# EAGLE design mattduino_mega_nano (EAGLE 9.1.0)

## Sheet 1 of 3: CPU
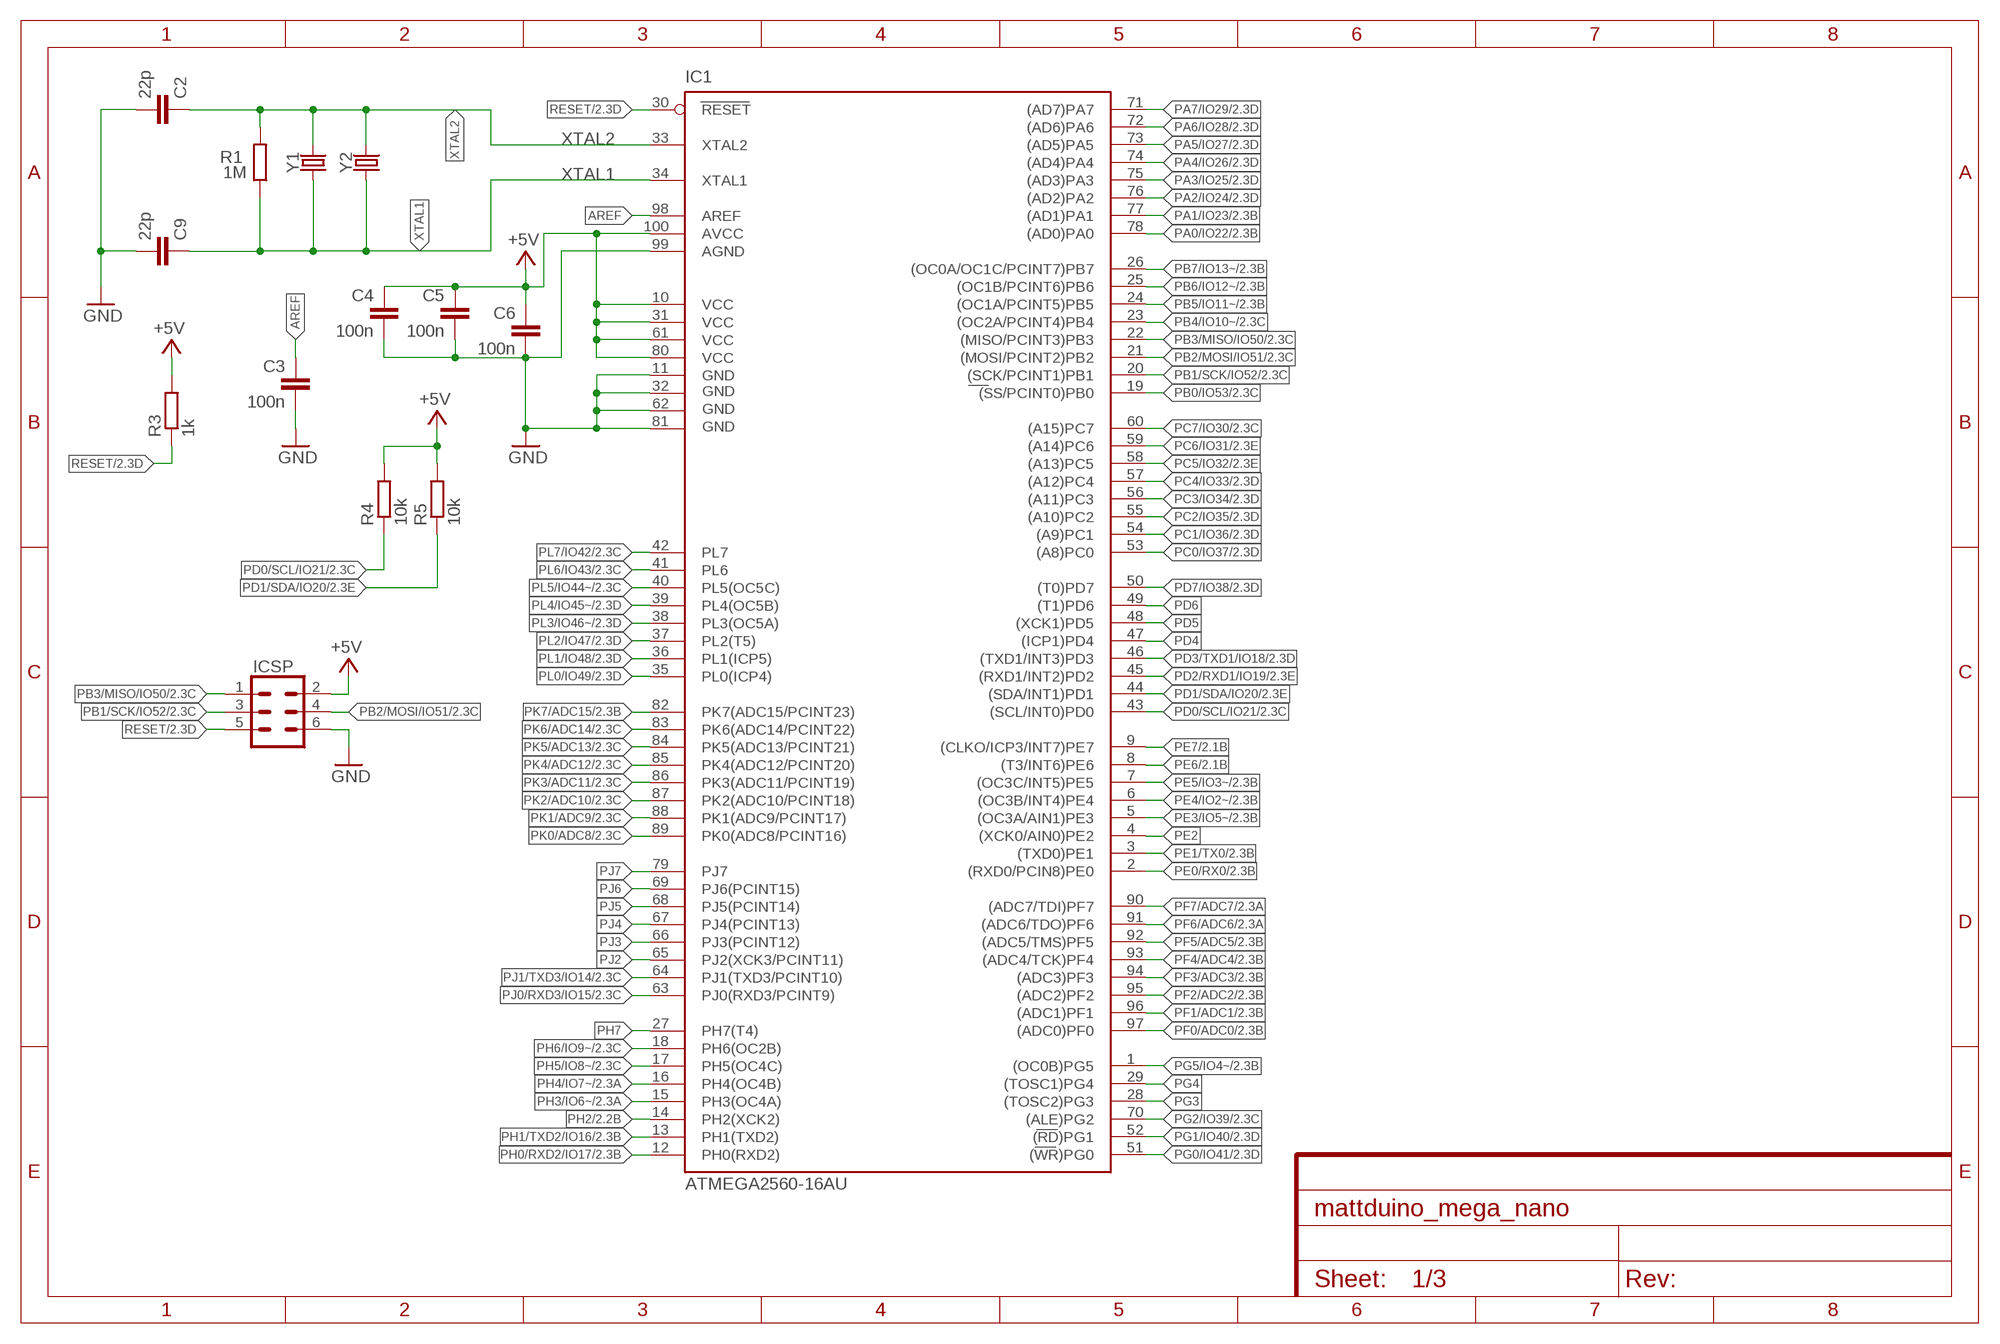
[diagram p0: schematic, sheet 1]

### Parts
C2  22p  C-EUC0603  [C0603]
C3  100n  C-EUC0603  [C0603]
C4  100n  C-EUC0603  [C0603]
C5  100n  C-EUC0603  [C0603]
C6  100n  C-EUC0603  [C0603]
C9  22p  C-EUC0603  [C0603]
IC1  ATMEGA2560-16AU  ATMEGA25602560-16AU  [TQFP100]
ICSP  CONN_03X2SHROUD  [2X3-SHROUDED]
R1  1M  R-EU_R0603  [R0603]
R3  1k  R-EU_R0603  [R0603]
R4  10k  R-EU_R0603  [R0603]
R5  10k  R-EU_R0603  [R0603]
Y1  CRYSTALPTH-HC49UV  [HC49U]
Y2  CRYSTALSMD-HC49UP  [HC49UP]

### Nets
+5V [power usb]: C4.1 C5.1 C6.1 IC1.10(VCC) IC1.31(VCC1) IC1.61(VCC2) IC1.80(VCC3) IC1.100(AVCC) ICSP.2 R3.2 R4.2 R5.2 ; also sheet 2,3
AREF: C3.1 IC1.98(AREF)
GND [gnd]: C2.2 C3.2 C4.2 C5.2 C6.2 C9.2 IC1.11(GND) IC1.32(GND1) IC1.62(GND2) IC1.81(GND3) IC1.99(AGND) ICSP.6 ; also sheet 2,3
PA0/IO22: IC1.78((AD0)PA0) ; also sheet 2
PA1/IO23: IC1.77((AD1)PA1) ; also sheet 2
PA2/IO24: IC1.76((AD2)PA2) ; also sheet 2
PA3/IO25: IC1.75((AD3)PA3) ; also sheet 2
PA4/IO26: IC1.74((AD4)PA4) ; also sheet 2
PA5/IO27: IC1.73((AD5)PA5) ; also sheet 2
PA6/IO28: IC1.72((AD6)PA6) ; also sheet 2
PA7/IO29: IC1.71((AD7)PA7) ; also sheet 2
PB0/IO53: IC1.19((SS/PCINT0)PB0) ; also sheet 2
PB1/SCK/IO52: IC1.20((SCK/PCINT1)PB1) ICSP.3 ; also sheet 2
PB2/MOSI/IO51: IC1.21((MOSI/PCINT2)PB2) ICSP.4 ; also sheet 2
PB3/MISO/IO50: IC1.22((MISO/PCINT3)PB3) ICSP.1 ; also sheet 2
PB4/IO10~: IC1.23((OC2A/PCINT4)PB4) ; also sheet 2
PB5/IO11~: IC1.24((OC1A/PCINT5)PB5) ; also sheet 2
PB6/IO12~: IC1.25((OC1B/PCINT6)PB6) ; also sheet 2
PB7/IO13~: IC1.26((OC0A/OC1C/PCINT7)PB7) ; also sheet 2
PC0/IO37: IC1.53((A8)PC0) ; also sheet 2
PC1/IO36: IC1.54((A9)PC1) ; also sheet 2
PC2/IO35: IC1.55((A10)PC2) ; also sheet 2
PC3/IO34: IC1.56((A11)PC3) ; also sheet 2
PC4/IO33: IC1.57((A12)PC4) ; also sheet 2
PC5/IO32: IC1.58((A13)PC5) ; also sheet 2
PC6/IO31: IC1.59((A14)PC6) ; also sheet 2
PC7/IO30: IC1.60((A15)PC7) ; also sheet 2
PD0/SCL/IO21: IC1.43((SCL/INT0)PD0) R4.1 ; also sheet 2
PD1/SDA/IO20: IC1.44((SDA/INT1)PD1) R5.1 ; also sheet 2
PD2/RXD1/IO19: IC1.45((RXD1/INT2)PD2) ; also sheet 2
PD3/TXD1/IO18: IC1.46((TXD1/INT3)PD3) ; also sheet 2
PD4: IC1.47((ICP1)PD4)
PD5: IC1.48((XCK1)PD5)
PD6: IC1.49((T1)PD6)
PD7/IO38: IC1.50((T0)PD7) ; also sheet 2
PE0/RX0: IC1.2((RXD0/PCIN8)PE0) ; also sheet 2
PE1/TX0: IC1.3((TXD0)PE1) ; also sheet 2
PE2: IC1.4((XCK0/AIN0)PE2)
PE3/IO5~: IC1.5((OC3A/AIN1)PE3) ; also sheet 2
PE4/IO2~: IC1.6((OC3B/INT4)PE4) ; also sheet 2
PE5/IO3~: IC1.7((OC3C/INT5)PE5) ; also sheet 2
PE6: IC1.8((T3/INT6)PE6) ; also sheet 2
PE7: IC1.9((CLKO/ICP3/INT7)PE7) ; also sheet 2
PF0/ADC0: IC1.97((ADC0)PF0) ; also sheet 2
PF1/ADC1: IC1.96((ADC1)PF1) ; also sheet 2
PF2/ADC2: IC1.95((ADC2)PF2) ; also sheet 2
PF3/ADC3: IC1.94((ADC3)PF3) ; also sheet 2
PF4/ADC4: IC1.93((ADC4/TCK)PF4) ; also sheet 2
PF5/ADC5: IC1.92((ADC5/TMS)PF5) ; also sheet 2
PF6/ADC6: IC1.91((ADC6/TDO)PF6) ; also sheet 2
PF7/ADC7: IC1.90((ADC7/TDI)PF7) ; also sheet 2
PG0/IO41: IC1.51((WR)PG0) ; also sheet 2
PG1/IO40: IC1.52((RD)PG1) ; also sheet 2
PG2/IO39: IC1.70((ALE)PG2) ; also sheet 2
PG3: IC1.28((TOSC2)PG3)
PG4: IC1.29((TOSC1)PG4)
PG5/IO4~: IC1.1((OC0B)PG5) ; also sheet 2
PH0/RXD2/IO17: IC1.12(PH0(RXD2)) ; also sheet 2
PH1/TXD2/IO16: IC1.13(PH1(TXD2)) ; also sheet 2
PH2: IC1.14(PH2(XCK2)) ; also sheet 2
PH3/IO6~: IC1.15(PH3(OC4A)) ; also sheet 2
PH4/IO7~: IC1.16(PH4(OC4B)) ; also sheet 2
PH5/IO8~: IC1.17(PH5(OC4C)) ; also sheet 2
PH6/IO9~: IC1.18(PH6(OC2B)) ; also sheet 2
PH7: IC1.27(PH7(T4))
PJ0/RXD3/IO15: IC1.63(PJ0(RXD3/PCINT9)) ; also sheet 2
PJ1/TXD3/IO14: IC1.64(PJ1(TXD3/PCINT10)) ; also sheet 2
PJ2: IC1.65(PJ2(XCK3/PCINT11))
PJ3: IC1.66(PJ3(PCINT12))
PJ4: IC1.67(PJ4(PCINT13))
PJ5: IC1.68(PJ5(PCINT14))
PJ6: IC1.69(PJ6(PCINT15))
PJ7: IC1.79(PJ7)
PK0/ADC8: IC1.89(PK0(ADC8/PCINT16)) ; also sheet 2
PK1/ADC9: IC1.88(PK1(ADC9/PCINT17)) ; also sheet 2
PK2/ADC10: IC1.87(PK2(ADC10/PCINT18)) ; also sheet 2
PK3/ADC11: IC1.86(PK3(ADC11/PCINT19)) ; also sheet 2
PK4/ADC12: IC1.85(PK4(ADC12/PCINT20)) ; also sheet 2
PK5/ADC13: IC1.84(PK5(ADC13/PCINT21)) ; also sheet 2
PK6/ADC14: IC1.83(PK6(ADC14/PCINT22)) ; also sheet 2
PK7/ADC15: IC1.82(PK7(ADC15/PCINT23)) ; also sheet 2
PL0/IO49: IC1.35(PL0(ICP4)) ; also sheet 2
PL1/IO48: IC1.36(PL1(ICP5)) ; also sheet 2
PL2/IO47: IC1.37(PL2(T5)) ; also sheet 2
PL3/IO46~: IC1.38(PL3(OC5A)) ; also sheet 2
PL4/IO45~: IC1.39(PL4(OC5B)) ; also sheet 2
PL5/IO44~: IC1.40(PL5(OC5C)) ; also sheet 2
PL6/IO43: IC1.41(PL6) ; also sheet 2
PL7/IO42: IC1.42(PL7) ; also sheet 2
RESET: IC1.30(RESET) ICSP.5 R3.1 ; also sheet 2
XTAL1: C9.1 IC1.34(XTAL1) R1.1 Y1.1 Y2.1
XTAL2: C2.1 IC1.33(XTAL2) R1.2 Y1.2 Y2.2

## Sheet 2 of 3: PINOUT
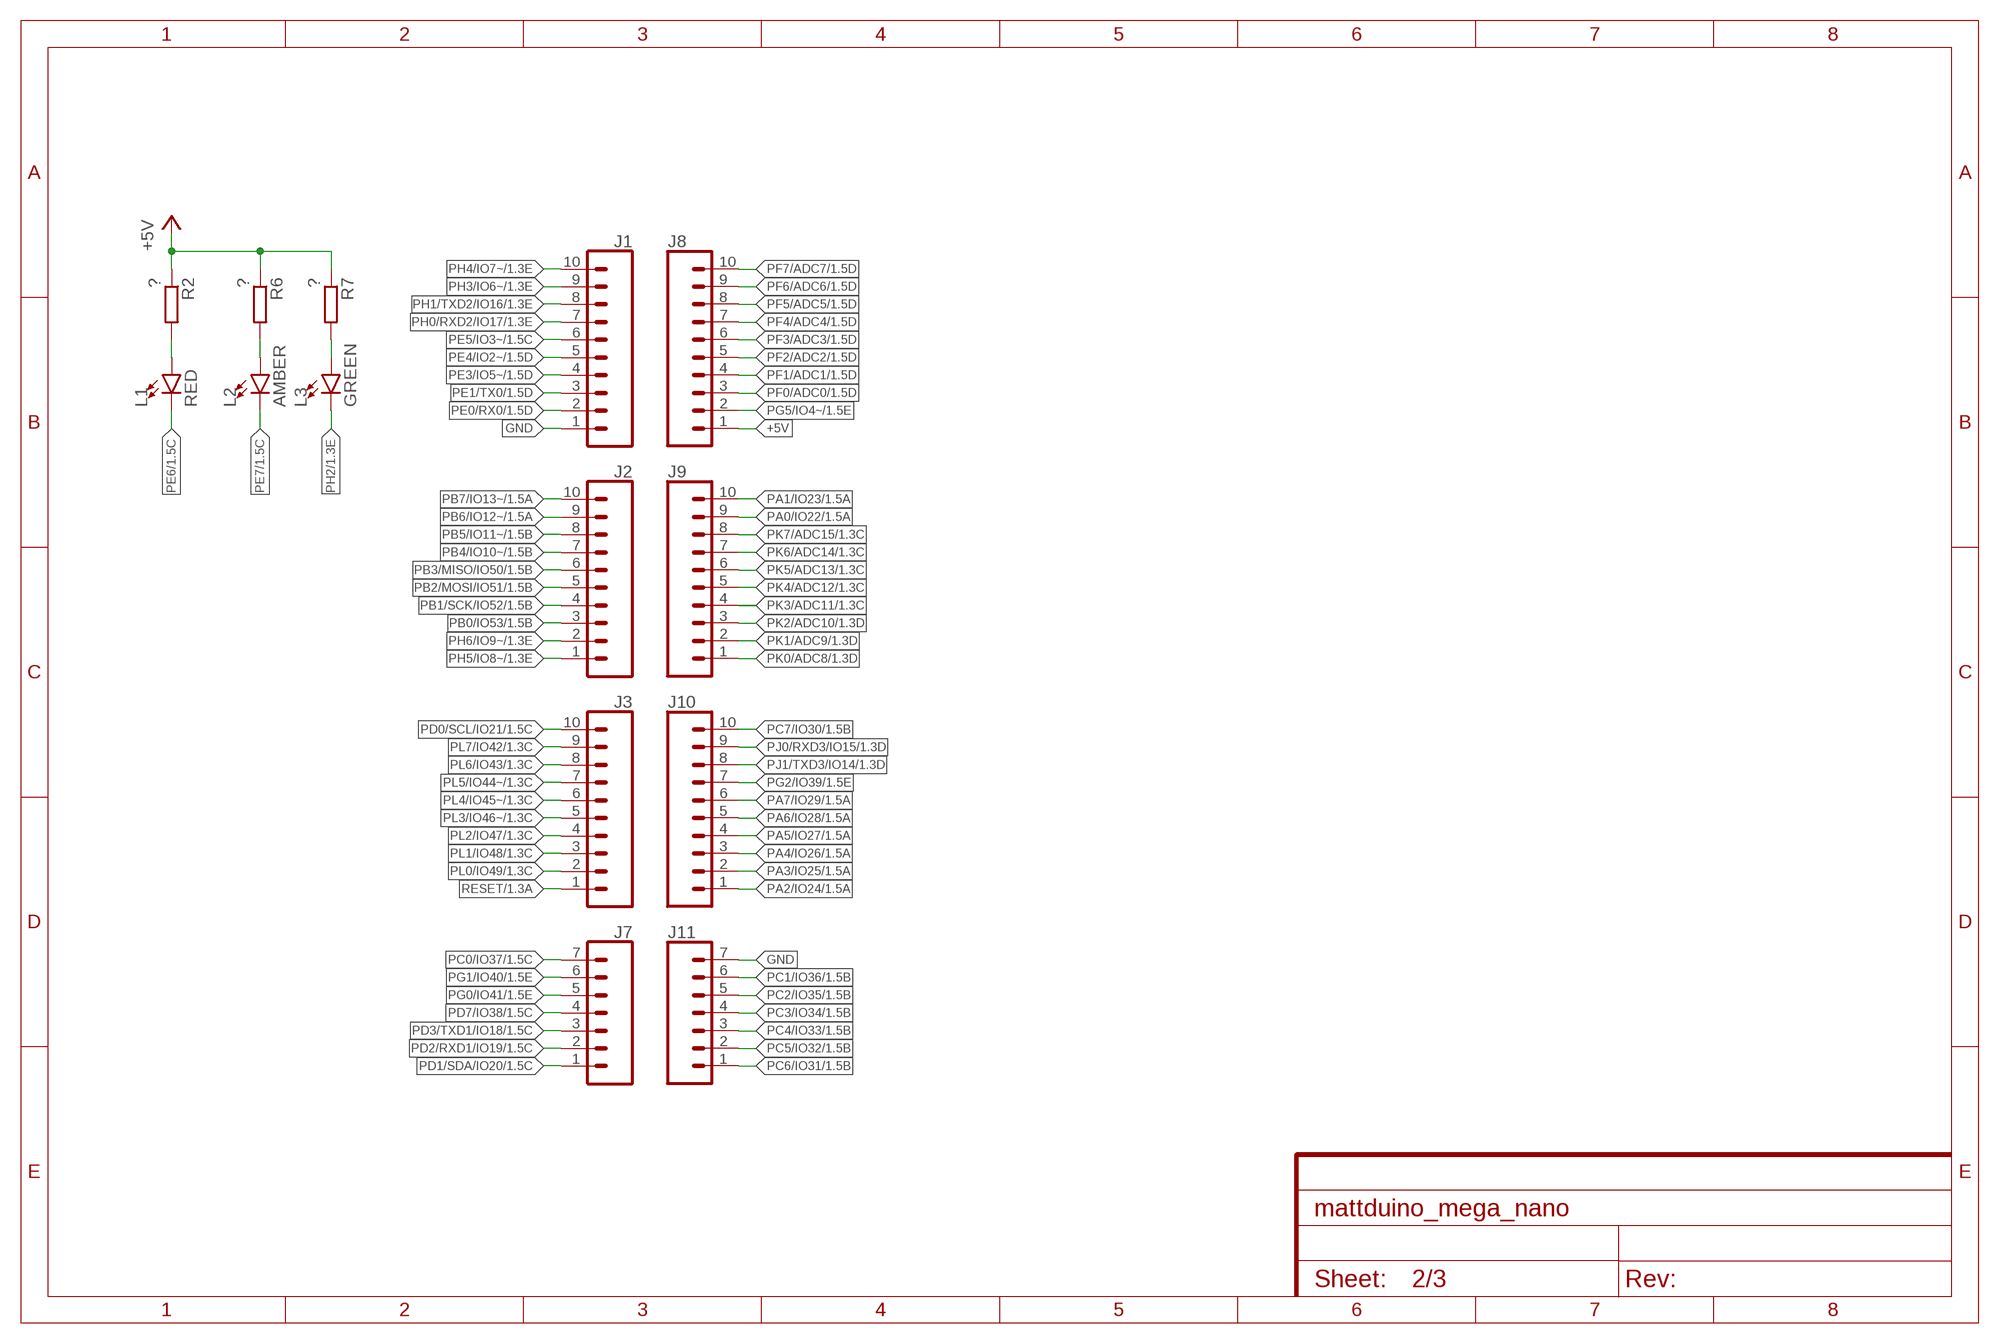
[diagram p1: schematic, sheet 2]

### Parts
J1  CONN_10LOCK  [1X10_LOCK]
J2  CONN_10LOCK  [1X10_LOCK]
J3  CONN_10LOCK  [1X10_LOCK]
J7  CONN_07LOCK  [1X07_LOCK]
J8  CONN_10LOCK  [1X10_LOCK]
J9  CONN_10LOCK  [1X10_LOCK]
J10  CONN_10LOCK  [1X10_LOCK]
J11  CONN_07LOCK  [1X07_LOCK]
L1  RED  LED0603  [LED-0603]
L2  AMBER  LED0603  [LED-0603]
L3  GREEN  LED0603  [LED-0603]
R2  ?  R-EU_R0603  [R0603]
R6  ?  R-EU_R0603  [R0603]
R7  ?  R-EU_R0603  [R0603]

### Nets
+5V [power usb]: J8.1 R2.1 R6.1 R7.1 ; also sheet 1,3
GND [gnd]: J1.1 J11.7 ; also sheet 1,3
N$1: L1.A R2.2
N$2: L2.A R6.2
N$4: L3.A R7.2
PA0/IO22: J9.9 ; also sheet 1
PA1/IO23: J9.10 ; also sheet 1
PA2/IO24: J10.1 ; also sheet 1
PA3/IO25: J10.2 ; also sheet 1
PA4/IO26: J10.3 ; also sheet 1
PA5/IO27: J10.4 ; also sheet 1
PA6/IO28: J10.5 ; also sheet 1
PA7/IO29: J10.6 ; also sheet 1
PB0/IO53: J2.3 ; also sheet 1
PB1/SCK/IO52: J2.4 ; also sheet 1
PB2/MOSI/IO51: J2.5 ; also sheet 1
PB3/MISO/IO50: J2.6 ; also sheet 1
PB4/IO10~: J2.7 ; also sheet 1
PB5/IO11~: J2.8 ; also sheet 1
PB6/IO12~: J2.9 ; also sheet 1
PB7/IO13~: J2.10 ; also sheet 1
PC0/IO37: J7.7 ; also sheet 1
PC1/IO36: J11.6 ; also sheet 1
PC2/IO35: J11.5 ; also sheet 1
PC3/IO34: J11.4 ; also sheet 1
PC4/IO33: J11.3 ; also sheet 1
PC5/IO32: J11.2 ; also sheet 1
PC6/IO31: J11.1 ; also sheet 1
PC7/IO30: J10.10 ; also sheet 1
PD0/SCL/IO21: J3.10 ; also sheet 1
PD1/SDA/IO20: J7.1 ; also sheet 1
PD2/RXD1/IO19: J7.2 ; also sheet 1
PD3/TXD1/IO18: J7.3 ; also sheet 1
PD7/IO38: J7.4 ; also sheet 1
PE0/RX0: J1.2 ; also sheet 1
PE1/TX0: J1.3 ; also sheet 1
PE3/IO5~: J1.4 ; also sheet 1
PE4/IO2~: J1.5 ; also sheet 1
PE5/IO3~: J1.6 ; also sheet 1
PE6: L1.C ; also sheet 1
PE7: L2.C ; also sheet 1
PF0/ADC0: J8.3 ; also sheet 1
PF1/ADC1: J8.4 ; also sheet 1
PF2/ADC2: J8.5 ; also sheet 1
PF3/ADC3: J8.6 ; also sheet 1
PF4/ADC4: J8.7 ; also sheet 1
PF5/ADC5: J8.8 ; also sheet 1
PF6/ADC6: J8.9 ; also sheet 1
PF7/ADC7: J8.10 ; also sheet 1
PG0/IO41: J7.5 ; also sheet 1
PG1/IO40: J7.6 ; also sheet 1
PG2/IO39: J10.7 ; also sheet 1
PG5/IO4~: J8.2 ; also sheet 1
PH0/RXD2/IO17: J1.7 ; also sheet 1
PH1/TXD2/IO16: J1.8 ; also sheet 1
PH2: L3.C ; also sheet 1
PH3/IO6~: J1.9 ; also sheet 1
PH4/IO7~: J1.10 ; also sheet 1
PH5/IO8~: J2.1 ; also sheet 1
PH6/IO9~: J2.2 ; also sheet 1
PJ0/RXD3/IO15: J10.9 ; also sheet 1
PJ1/TXD3/IO14: J10.8 ; also sheet 1
PK0/ADC8: J9.1 ; also sheet 1
PK1/ADC9: J9.2 ; also sheet 1
PK2/ADC10: J9.3 ; also sheet 1
PK3/ADC11: J9.4 ; also sheet 1
PK4/ADC12: J9.5 ; also sheet 1
PK5/ADC13: J9.6 ; also sheet 1
PK6/ADC14: J9.7 ; also sheet 1
PK7/ADC15: J9.8 ; also sheet 1
PL0/IO49: J3.2 ; also sheet 1
PL1/IO48: J3.3 ; also sheet 1
PL2/IO47: J3.4 ; also sheet 1
PL3/IO46~: J3.5 ; also sheet 1
PL4/IO45~: J3.6 ; also sheet 1
PL5/IO44~: J3.7 ; also sheet 1
PL6/IO43: J3.8 ; also sheet 1
PL7/IO42: J3.9 ; also sheet 1
RESET: J3.1 ; also sheet 1

## Sheet 3 of 3: Power
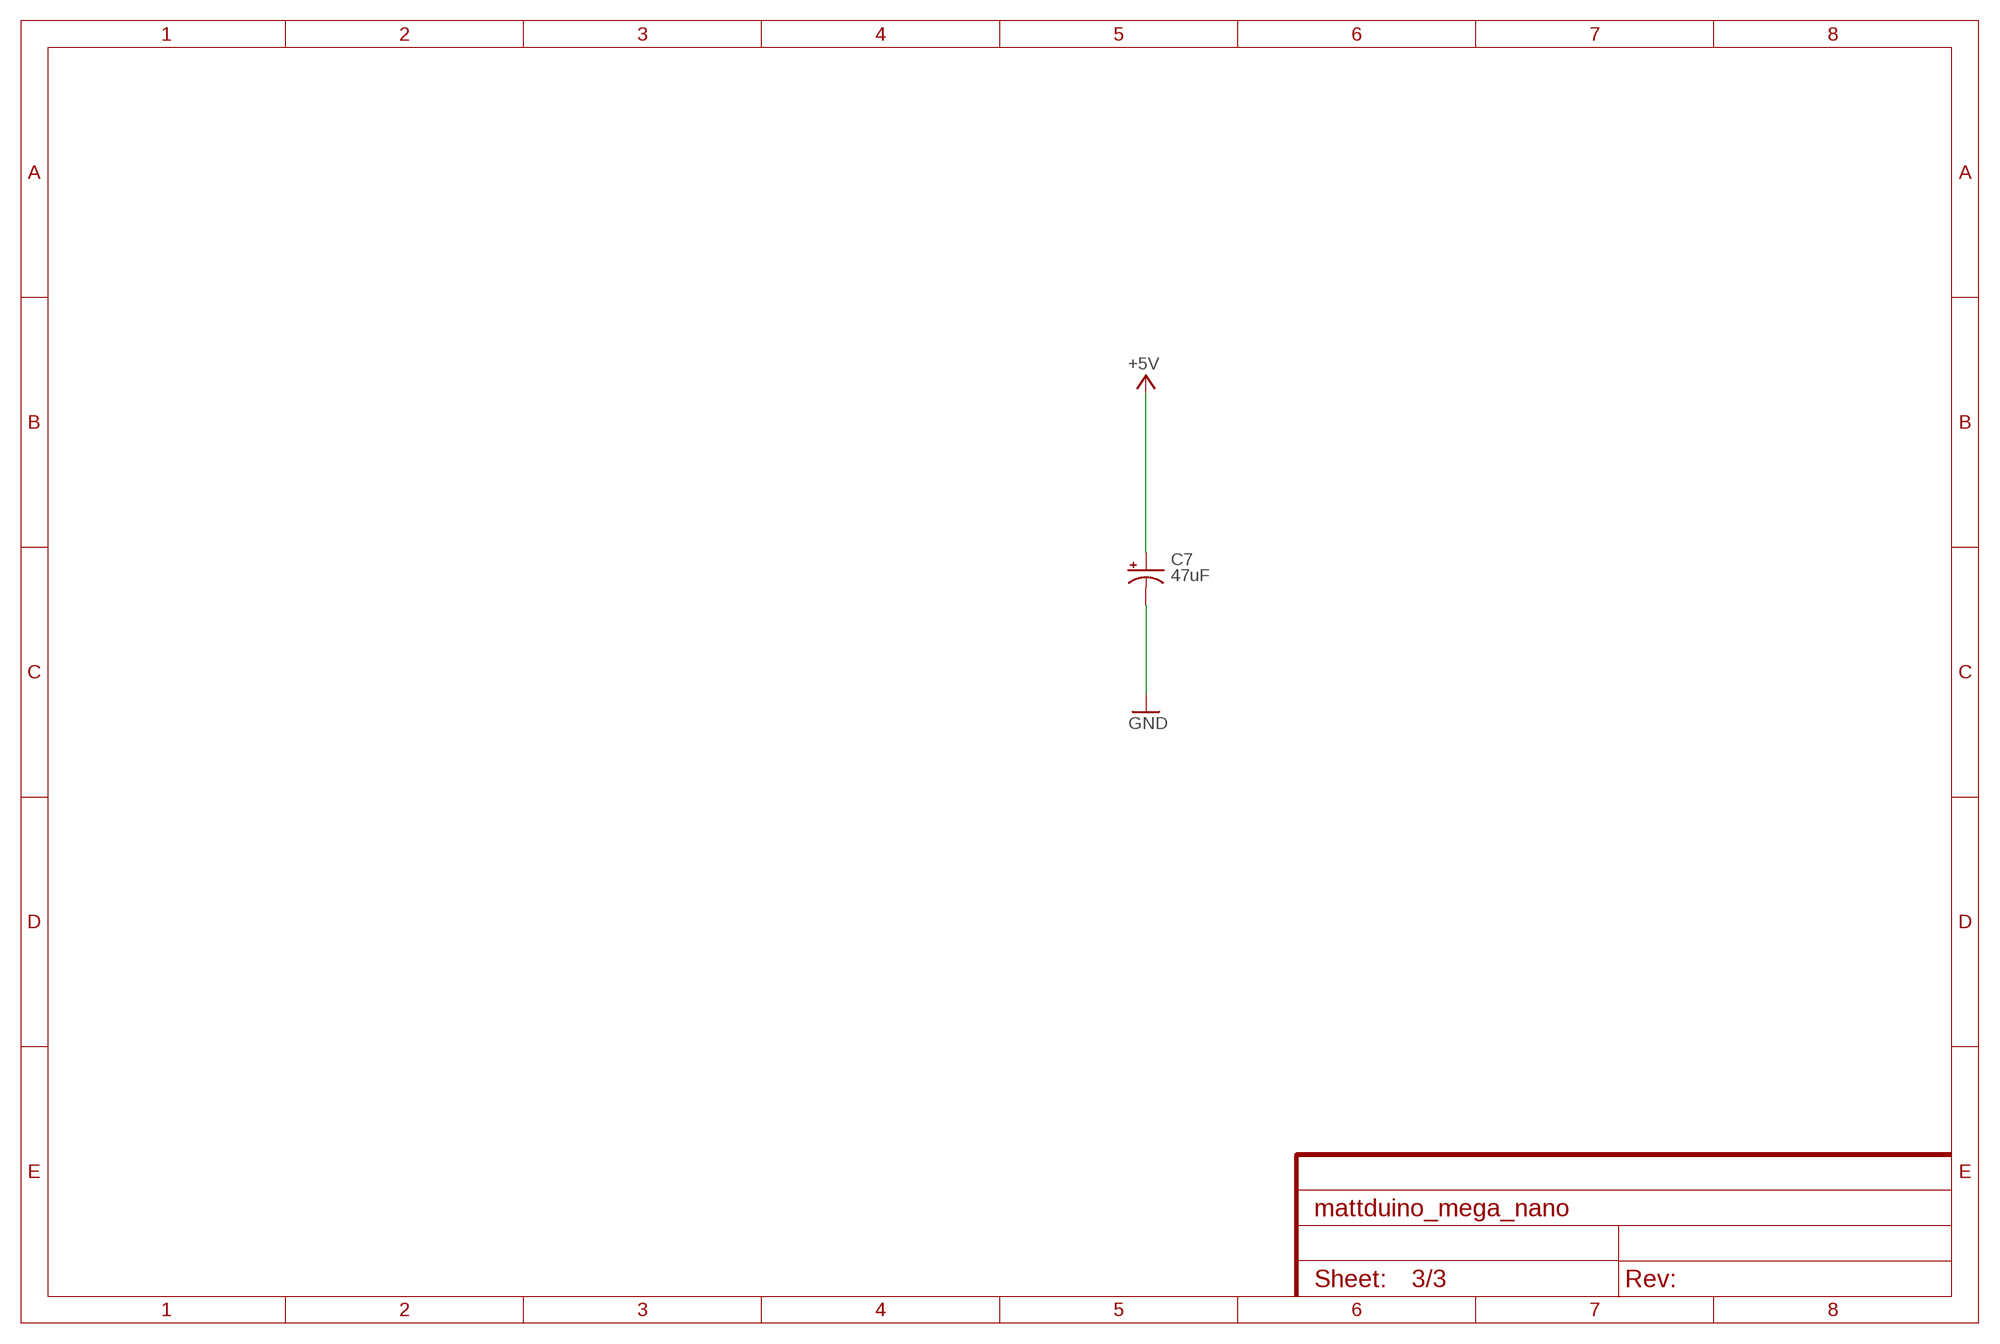
[diagram p2: schematic, sheet 3]

### Parts
C7  47uF  47UF-POLAR-PANASONIC_D-35V-20%  [PANASONIC_D]

### Nets
+5V [power usb]: C7.+ ; also sheet 1,2
GND [gnd]: C7.- ; also sheet 1,2

## Library data of the parts
C2-C6 C9 = rcl:C-EU: CAPACITOR, European symbol; SPICEPREFIX: C
C7 = SparkFun-Capacitors:47UF-POLAR: 47µF polarized capacitors A capacitor is a passive two-terminal electrical component used to store electrical energy temporarily in an electric field.; PROD_ID: CAP-08478
IC1 = SmartPrj:ATMEGA2560: MICROCONTROLLER 64/128/256 Kbytes FLASH 4 Kbytes EEPROM 8 Kbytes SRAM 86 General Purpose I/O pins 12-channels16-bit PWM 4 x Serial USARTs 16-channels 10-bit A/D
ICSP = SparkFun-Connectors:CONN_03X2: Multi connection point. Often used as Generic Header-pin footprint for 0.1 inch spaced/style header connections You can populate with any combo of single row headers, but if you'd like an exact match, check these: Header - 2x3 (Male, 0.1") <https://www.sparkfun.com/products/12807> (PRT-12807) Header - 2x3 (Female, 0.1") <https://www.sparkfun.com/products/13010> (PRT-13010) 2x3 Pin Shrouded Header <https://www.sparkfun.com/products/10877> (PRT-10877) On any of the 0.1 inch spaced packages, you can populate with these: Break Away Headers - Straight <https://www.sparkfun.com/products/116> (PRT-00116) Break Away Male Headers - Right Angle <https://www.sparkfun.com/products/553> (PRT-00553) Female Headers <https://www.sparkfun.com/products/115> (PRT-00115) Break Away Headers - Machine Pin <https://www.sparkfun.com/products/117> (PRT-00117) Break Away Female Headers - Swiss Machine Pin <https://www.sparkfun.com/products/743> (PRT-00743) Special note: the shrouded connector mates well with our 3x2 ribbon cables: Ribbon Crimp Connector - 6-pin (2x3, Female) <https://www.sparkfun.com/products/10651> (PRT-10651) Ribbon Cable - 6 wire (15ft) <https://www.sparkfun.com/products/10646> (PRT-10646); PROD_ID: CONN-10681; SF_ID: PRT_10877
J1-J3 J8-J10 = SparkFun-Connectors:CONN_10: Multi connection point. Often used as Generic Header-pin footprint for 0.1 inch spaced/style header connections On any of the 0.1 inch spaced packages, you can populate with these: Break Away Headers - Straight <https://www.sparkfun.com/products/116> (PRT-00116) Break Away Male Headers - Right Angle <https://www.sparkfun.com/products/553> (PRT-00553) Female Headers <https://www.sparkfun.com/products/115> (PRT-00115) Break Away Headers - Machine Pin <https://www.sparkfun.com/products/117> (PRT-00117) Break Away Female Headers - Swiss Machine Pin <https://www.sparkfun.com/products/743> (PRT-00743) Arduino Stackable Header - 10 Pin <https://www.sparkfun.com/products/11376> (PRT-11376) For SCREWTERMINALS and SPRING TERMINALS visit here: Screw Terimnals on SparkFun.com <https://www.sparkfun.com/search/results?term=Screw+Terminals> (5mm/3.5mm/2.54mm spacing) This device is also useful as a general connection point to wire up your design to another part of your project. Our various solder wires solder well into these plated through hole pads. Hook-Up Wire - Assortment (Stranded, 22 AWG) <https://www.sparkfun.com/products/11375> (PRT-11375) Hook-Up Wire - Assortment (Solid Core, 22 AWG) <https://www.sparkfun.com/products/11367> (PRT-11367) View the entire wire category on our website here <https://www.sparkfun.com/categories/141> Special notes: Molex polarized connector foot print use with SKU : PRT-08231 with associated crimp pins and housings. 1MM SMD Version SKU: PRT-10208 NOTES ON THE VARIANTS LOCK and LOCK_LONGPADS... This footprint was designed to help hold the alignment of a through-hole component (i.e. 6-pin header) while soldering it into place. You may notice that each hole has been shifted either up or down by 0.005 of an inch from it's more standard position (which is a perfectly straight line). This slight alteration caused the pins (the squares in the middle) to touch the edges of the holes. Because they are alternating, it causes a "brace" to hold the component in place. 0.005 has proven to be the perfect amount of "off-center" position when using our standard breakaway headers. Although looks a little odd when you look at the bare footprint, once you have a header in there, the alteration is very hard to notice. Also,if you push a header all the way into place, it is covered up entirely on the bottom side.
J7 J11 = SparkFun-Connectors:CONN_07: Multi connection point. Often used as Generic Header-pin footprint for 0.1 inch spaced/style header connections On any of the 0.1 inch spaced packages, you can populate with these: Break Away Headers - Straight <https://www.sparkfun.com/products/116> (PRT-00116) Break Away Male Headers - Right Angle <https://www.sparkfun.com/products/553> (PRT-00553) Female Headers <https://www.sparkfun.com/products/115> (PRT-00115) Break Away Headers - Machine Pin <https://www.sparkfun.com/products/117> (PRT-00117) Break Away Female Headers - Swiss Machine Pin <https://www.sparkfun.com/products/743> (PRT-00743) For SCREWTERMINALS and SPRING TERMINALS visit here: Screw Terimnals on SparkFun.com <https://www.sparkfun.com/search/results?term=Screw+Terminals> (5mm/3.5mm/2.54mm spacing) This device is also useful as a general connection point to wire up your design to another part of your project. Our various solder wires solder well into these plated through hole pads. Hook-Up Wire - Assortment (Stranded, 22 AWG) <https://www.sparkfun.com/products/11375> (PRT-11375) Hook-Up Wire - Assortment (Solid Core, 22 AWG) <https://www.sparkfun.com/products/11367> (PRT-11367) View the entire wire category on our website here <https://www.sparkfun.com/categories/141> Special notes: Molex polarized connector foot print use with SKU : PRT-08231 with associated crimp pins and housings. 1MM SMD Version SKU: PRT-10208 NOTES ON THE VARIANTS LOCK and LOCK_LONGPADS... This footprint was designed to help hold the alignment of a through-hole component (i.e. 6-pin header) while soldering it into place. You may notice that each hole has been shifted either up or down by 0.005 of an inch from it's more standard position (which is a perfectly straight line). This slight alteration caused the pins (the squares in the middle) to touch the edges of the holes. Because they are alternating, it causes a "brace" to hold the component in place. 0.005 has proven to be the perfect amount of "off-center" position when using our standard breakaway headers. Although looks a little odd when you look at the bare footprint, once you have a header in there, the alteration is very hard to notice. Also,if you push a header all the way into place, it is covered up entirely on the bottom side.
L1-L3 = SparkFun-LED:LED: LED (Generic) Standard schematic elements and footprints for 5mm, 3mm, 1206, and 0603 sized LEDs. Generic LEDs with no color specified.
R1-R7 = rcl:R-EU_: RESISTOR, European symbol; SPICEPREFIX: R
Y1 Y2 = SparkFun-Clocks:CRYSTAL: Crystals (Generic) These are passive quartz crystals, which can be used as a clock source for a microcontroller. Crystal's are two-terminal devices. They require external "load" capacitors to generate an oscillating signal.

## Net classes
0 default: width 0.305 mm
1 power: width 0.305 mm
2 gnd: width 0.305 mm
3 power usb: width 0.305 mm

## Board
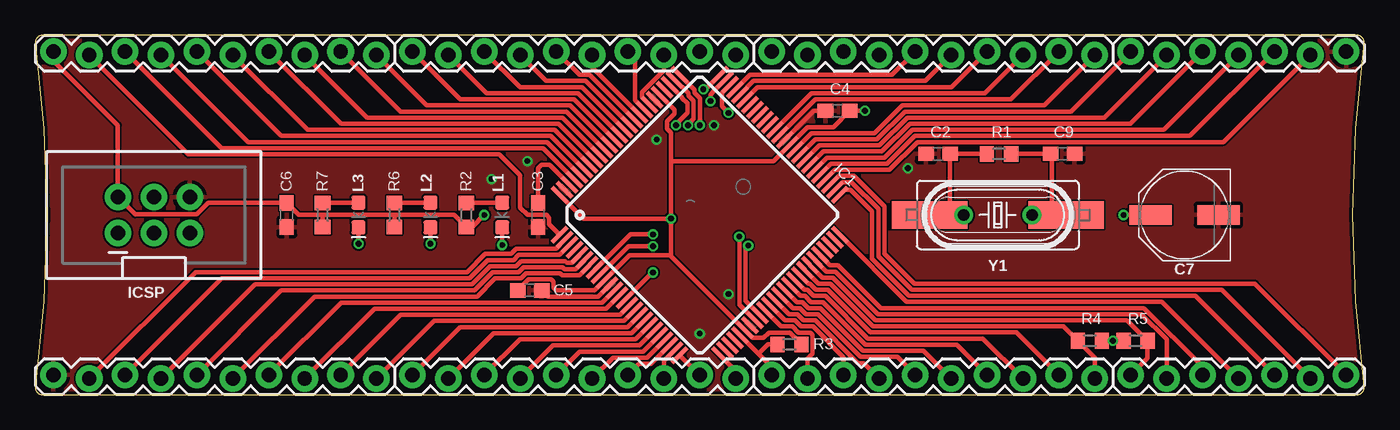
[diagram p3: board, top side]
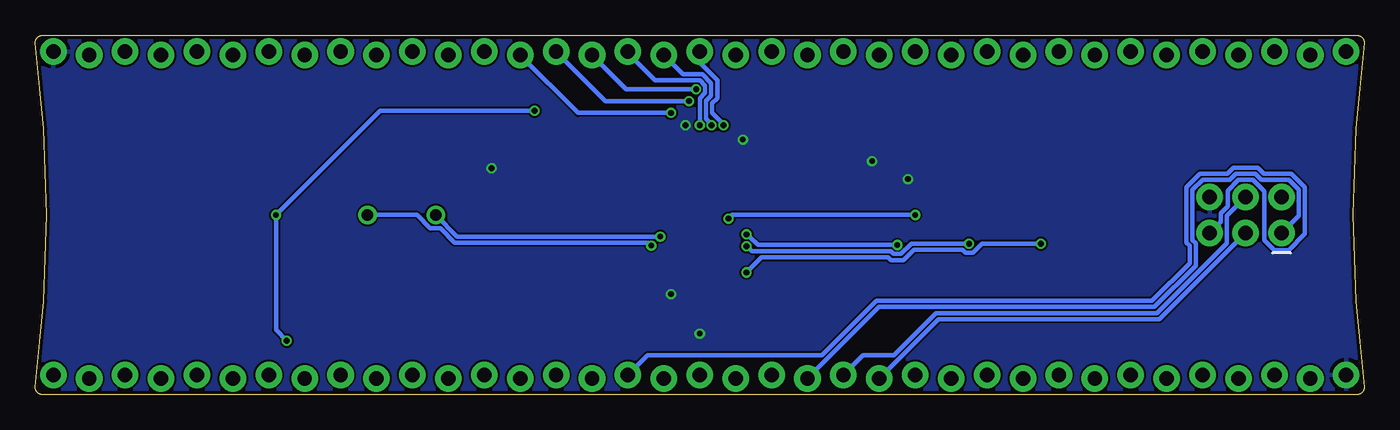
[diagram p4: board, bottom side, seen from below]

Size 93.98 x 25.4 mm. Coordinates in mm from the lower left corner, seen from the top.
Outline: 0.51,0 93.47,0 arc90 93.98,0.51 arc-15 93.98,24.89 arc90 93.47,25.4 0.51,25.4 arc90 0,24.89 arc-15 0,0.51 arc90 0.51,0
Copper layers (1*16): Top 0.035mm / dielectric 1.5mm / Bottom 0.035mm
Design rules "dirtypcbs": minimum track width 5mil, minimum drill 12mil, track to track 5mil, track to pad 5mil, pad to pad 5mil, via to via 5mil, smd to smd 0mil, copper to edge 10mil, drill to drill 10mil, minimum pad ring 10mil, minimum via ring 6mil, stop-mask expansion 2mil, vias tented up to drill 25mil, thermal gap 10mil

### Footprints (pad centres in the part's own frame; a part is rotated, then mirrored left to right if it is on the bottom)
C0603 = smd 1.1 x 1: 1 -0.85,0; 2 0.85,0
PANASONIC_D = smd 3 x 1.4: + 2.4,0; - -2.4,0
TQFP100 = smd 1.5 x 0.3: 1 -8,6; 2 -8,5.5; 3 -8,5; 4 -8,4.5; 5 -8,4; 6 -8,3.5; 7 -8,3; 8 -8,2.5; 9 -8,2; 10 -8,1.5; 11 -8,1; 12 -8,0.5; 13 -8,0; 14 -8,-0.5; 15 -8,-1; 16 -8,-1.5; 17 -8,-2; 18 -8,-2.5; 19 -8,-3; 20 -8,-3.5; 21 -8,-4; 22 -8,-4.5; 23 -8,-5; 24 -8,-5.5; 25 -8,-6; 51 8,-6; 52 8,-5.5; 53 8,-5; 54 8,-4.5; 55 8,-4; 56 8,-3.5; 57 8,-3; 58 8,-2.5; 59 8,-2; 60 8,-1.5; 61 8,-1; 62 8,-0.5; 63 8,0; 64 8,0.5; 65 8,1; 66 8,1.5; 67 8,2; 68 8,2.5; 69 8,3; 70 8,3.5; 71 8,4; 72 8,4.5; 73 8,5; 74 8,5.5; 75 8,6 | smd 0.3 x 1.5: 26 -6,-8; 27 -5.5,-8; 28 -5,-8; 29 -4.5,-8; 30 -4,-8; 31 -3.5,-8; 32 -3,-8; 33 -2.5,-8; 34 -2,-8; 35 -1.5,-8; 36 -1,-8; 37 -0.5,-8; 38 0,-8; 39 0.5,-8; 40 1,-8; 41 1.5,-8; 42 2,-8; 43 2.5,-8; 44 3,-8; 45 3.5,-8; 46 4,-8; 47 4.5,-8; 48 5,-8; 49 5.5,-8; 50 6,-8; 76 6,8; 77 5.5,8; 78 5,8; 79 4.5,8; 80 4,8; 81 3.5,8; 82 3,8; 83 2.5,8; 84 2,8; 85 1.5,8; 86 1,8; 87 0.5,8; 88 0,8; 89 -0.5,8; 90 -1,8; 91 -1.5,8; 92 -2,8; 93 -2.5,8; 94 -3,8; 95 -3.5,8; 96 -4,8; 97 -4.5,8; 98 -5,8; 99 -5.5,8; 100 -6,8
2X3-SHROUDED = drill 1.016 pad 1.88: 1 -1.27,2.54; 2 1.27,2.54; 3 -1.27,0; 4 1.27,0; 5 -1.27,-2.54; 6 1.27,-2.54
1X10_LOCK = drill 1.016 pad 1.88: 1 0,0.127; 2 2.54,-0.127; 3 5.08,0.127; 4 7.62,-0.127; 5 10.16,0.127; 6 12.7,-0.127; 7 15.24,0.127; 8 17.78,-0.127; 9 20.32,0.127; 10 22.86,-0.127
1X07_LOCK = drill 1.016 pad 1.88: 1 0,0.127; 2 2.54,-0.127; 3 5.08,0.127; 4 7.62,-0.127; 5 10.16,0.127; 6 12.7,-0.127; 7 15.24,0.127
LED-0603 = smd 1 x 1: A -0.877,0; C 0.877,0
R0603 = smd 1 x 1.1: 1 -0.85,0; 2 0.85,0
HC49U = drill 0.813: 1 -2.413,0; 2 2.413,0
HC49UP = smd 5.334 x 1.93: 1 -4.826,0; 2 4.826,0

### Placement (x,y rotation side)
C2  63.84,17.02 180 top
C3  35.56,12.7 270 top
C4  56.73,20.07 180 top
C5  34.96,7.37 0 top
C6  17.78,12.7 270 top
C7  81.28,12.7 180 top
C9  72.64,17.02 0 top
IC1  46.99,12.7 45 top
ICSP  8.38,12.7 90 top
J1  1.27,1.27 0 top
J2  26.67,1.27 0 top
J3  52.07,1.27 0 top
J7  77.47,1.27 0 top
J8  1.27,24.13 0 top
J9  26.67,24.13 0 top
J10  52.07,24.13 0 top
J11  77.47,24.13 0 top
L1  33.02,12.7 270 top
L2  27.94,12.7 270 top
L3  22.86,12.7 270 top
R1  68.16,17.02 180 top
R2  30.48,12.7 90 top
R3  53.34,3.56 0 top
R4  74.59,3.81 0 top
R5  77.81,3.81 180 top
R6  25.4,12.7 90 top
R7  20.32,12.7 90 top
Y1  68.07,12.7 180 top
Y2  68.07,12.7 180 top

### Tracks (layer width: path | path; a pad name or v marks a point on that pad's centre or on a via)
+5V  (via drill 0.41)
  Top 0.305: R3.2 53.36,4.38 51.87,4.38 51.49,4.01 50.73,4.01 IC1.31 44.88,9.86 | R4.2 v76.2,3.81 R5.2 | C5.1 34.89,8.14 36.32,8.14 36.48,8.14 36.64,7.98 36.64,7.55 36.83,7.37 39.53,7.37 IC1.10 42.02,9.86 44.88,9.86 | 20.32,12.7 18.63,12.7 C6.1 12.23,13.55 11.43,12.75 7.06,12.75 ICSP.2 5.84,19.05 1.27,23.62 J8.1 | 20.32,12.7 25.4,12.7 | 25.4,12.7 29.63,12.7 R2.1 30.9,11.85 v31.75,12.7 | R6.1 25.4,12.7 | R7.1 20.32,12.7 | C7.+ v76.96,12.7 | v58.67,20.07 C4.1 56.43,18.92 54.62,18.92 IC1.61 52.21,16.51 44.96,16.51 | 44.96,16.51 44.96,18.51 44.68,18.79 44.68,19.31 45.21,19.85 45.21,20.14 IC1.80 | 44.88,9.86 44.96,9.93 v44.96,12.45 | v44.96,12.45 44.96,16.51 | IC1.100 38.76,12.45 v44.96,12.45
  Bottom 0.305: v76.2,3.81 76.96,4.57 v76.96,12.7 69.6,20.07 v58.67,20.07 | v31.75,12.7 44.7,12.7 v44.96,12.45
AREF
  Top 0.305: IC1.98 36.36,16.26 35.81,16.26 35.56,16 C3.1
GND  (via drill 0.41)
  Top 0.305: IC1.62 55.06,20.07 C4.2 | IC1.11 39.81,6.93 36.25,6.93 C5.2
  other vias: 32.26,15.24 34.8,16.51 46.99,4.32 48.01,19.05 43.94,18.03 61.72,16 49.02,7.11
  pour Bottom: -2.03,38.1 102.11,38.1 102.11,-7.37 -2.29,-7.37 -2.29,38.1
  pour Top: -3.81,39.88 96.77,39.88 96.77,-2.03 -3.81,-2.03
N$1
  Top 0.305: L1.A 30.51,13.58 R2.2
N$2
  Top 0.305: L2.A 25.43,13.58 R6.2
N$4
  Top 0.305: L3.A 20.35,13.58 R7.2
PA0/IO22  (via drill 0.41)
  Top 0.305: v45.31,19.05 45.52,19.25 45.52,19.31 46.13,19.92 46.13,20.59 45.74,20.97 45.74,21.02 IC1.78
  Bottom 0.305: v45.31,19.05 45.52,19.25 45.52,19.31 46.13,19.92 46.13,20.59 45.74,20.97 45.74,22.21 46.99,23.45 J9.9
PA1/IO23  (via drill 0.41)
  Top 0.305: IC1.77 46.18,21.29 46.18,21.15 46.56,20.77 46.56,19.52 46.35,19.31 46.35,19.25 v46.15,19.05
  Bottom 0.305: v46.15,19.05 46.35,19.25 46.35,19.31 46.56,19.52 46.56,20.77 46.18,21.15 46.18,22.03 46.8,22.66 48.18,22.66 J9.10
PA2/IO24  (via drill 0.41)
  Top 0.305: IC1.76 46.61,21.57 46.61,21.33 46.99,20.95 v46.99,19.05
  Bottom 0.305: J10.1 52.07,24.13 50.16,22.23 46.98,22.23 46.61,21.85 46.61,21.33 46.99,20.95 v46.99,19.05
PA3/IO25  (via drill 0.41)
  Top 0.305: IC1.75 47.4,21.59 v47.24,21.59
  Bottom 0.305: v47.24,21.59 49.28,21.59 52.2,21.59 J10.2
PA4/IO26  (via drill 0.41)
  Top 0.305: v47.75,20.75 47.75,21.2 47.88,21.33 47.88,21.37 IC1.74
  Bottom 0.305: v47.75,20.75 53.65,20.75 J10.3
PA5/IO27  (via drill 0.41)
  Top 0.305: IC1.73 48.55,21.33 48.55,20.39 v49.02,19.91
  Bottom 0.305: v49.02,19.91 55.6,19.91 J10.4
PA6/IO28
  Top 0.305: IC1.72 50.53,22.61 60.58,22.61 J10.5
PA7/IO29
  Top 0.305: IC1.71 50.81,22.17 62.94,22.17 J10.6
PB0/IO53
  Top 0.305: IC1.19 42.44,3.91 34.27,3.91 J2.3
PB1/SCK/IO52
  Top 0.305: IC1.20 42.72,3.48 36.63,3.48 J2.4
  Bottom 0.305: ICSP.3 14.48,5.33 30.1,5.33 J2.4
PB2/MOSI/IO51
  Top 0.305: IC1.21 42.99,3.05 38.48,3.05 J2.5
  Bottom 0.305: ICSP.4 9.7,12.65 9.7,10.72 14.66,5.77 30.28,5.77 33.25,2.79 35.43,2.79 J2.5
PB3/MISO/IO50
  Top 0.305: J2.6 40.84,2.62 43.27,2.62 IC1.22
  Bottom 0.305: ICSP.1 4.62,12.65 4.62,14.47 5.34,15.19 7.27,15.19 7.7,15.62 9.07,15.62 9.5,15.19 11.43,15.19 12.14,14.47 12.14,10.93 11.91,10.7 11.91,9.12 14.84,6.2 34.31,6.2 J2.6
PB4/IO10~
  Top 0.305: J2.7 42.7,2.18 43.55,2.18 IC1.23
PB5/IO11~
  Top 0.305: IC1.24 44.45,2.38 J2.8
PB6/IO12~
  Top 0.305: IC1.25 46.98,1.4 J2.9
PB7/IO13~
  Top 0.305: IC1.26 49.53,1.68 J2.10
PC0/IO37
  Top 0.305: J7.7 86.26,7.85 62.16,7.85 60.05,9.96 60.05,11.94 | 60.05,11.94 60.05,13.31 57.9,15.46 56.82,15.46 IC1.53 | 60.05,11.43 60.05,11.94
PC1/IO36
  Top 0.305: J11.6 84.02,17.86 62.38,17.86 60.42,15.89 56.55,15.89 IC1.54
PC2/IO35
  Top 0.305: J11.5 81.66,18.29 62.21,18.29 60.24,16.32 56.27,16.32 IC1.55
PC3/IO34
  Top 0.305: J11.4 79.81,18.72 62.03,18.72 60.06,16.76 56,16.76 IC1.56
PC4/IO33
  Top 0.305: J11.3 77.44,19.15 61.85,19.15 59.89,17.19 55.72,17.19 IC1.57
PC5/IO32
  Top 0.305: J11.2 75.59,19.58 61.67,19.58 59.71,17.62 55.45,17.62 IC1.58
PC6/IO31
  Top 0.305: J11.1 73.23,20.02 61.49,20.02 59.53,18.05 55.17,18.05 IC1.59
PC7/IO30
  Top 0.305: J10.10 71.37,20.45 61.31,20.45 59.35,18.48 54.9,18.48 IC1.60
PD0/SCL/IO21
  Top 0.305: IC1.43 54.95,8.27 54.97,8.27 55.4,7.84 56.24,7.84 59.25,4.83 71.25,4.83 72.72,4.83 R4.1 74.93,2.62 J3.10
PD1/SDA/IO20
  Top 0.305: IC1.44 55.66,8.27 56.41,8.27 59.43,5.26 73.61,5.26 77.21,5.26 R5.1 78.66,2.59 J7.1
PD2/RXD1/IO19
  Top 0.305: IC1.45 55.94,8.7 56.59,8.7 59.61,5.69 78.23,5.69 80.01,3.91 J7.2
PD3/TXD1/IO18
  Top 0.305: IC1.46 56.21,9.13 56.77,9.13 59.79,6.12 78.41,6.12 82.49,2.04 82.49,1.46 J7.3
PD7/IO38
  Top 0.305: IC1.50 61.62,6.55 79.68,6.55 J7.4
PE0/RX0
  Top 0.305: J1.2 11.33,8.66 30.53,8.66 31.81,9.95 33.64,9.95 34,10.3 36.82,10.3 IC1.2
PE1/TX0
  Top 0.305: J1.3 13.18,8.23 30.7,8.23 31.99,9.51 33.82,9.51 34.18,9.87 37.09,9.87 IC1.3
PE3/IO5~
  Top 0.305: J1.4 15.54,7.8 30.88,7.8 32.17,9.08 34,9.08 34.36,9.44 37.48,9.44 37.61,9.31 37.94,9.31 IC1.5
PE4/IO2~
  Top 0.305: J1.5 17.4,7.37 31.06,7.37 32.35,8.65 34.18,8.65 34.54,9.01 37.3,9.01 37.43,8.88 38.22,8.88 IC1.6
PE5/IO3~
  Top 0.305: J1.6 19.76,6.93 31.24,6.93 32.52,8.22 34.35,8.22 34.72,8.58 37.12,8.58 37.25,8.45 38.49,8.45 IC1.7
PE6  (via drill 0.41)
  Top 0.305: L1.C v33.02,10.58 | IC1.8 42.08,11.33 v43.69,11.33
  Bottom 0.305: v43.69,11.33 43.48,11.12 43.42,11.12 42.88,10.58 v33.02,10.58
PE7  (via drill 0.41)
  Top 0.305: L2.C v27.94,10.67 | IC1.9 41.95,10.49 v43.69,10.49
  Bottom 0.305: v27.94,10.67 32.03,10.67 32.76,9.95 33.28,9.95 33.49,10.15 38.61,10.15 | 38.61,10.15 39.71,10.15 | 39.71,10.15 38.61,10.15 | 39.71,10.15 43.29,10.15 43.42,10.29 43.48,10.29 v43.69,10.49
PF0/ADC0
  Top 0.305: IC1.97 35.9,17.42 27.94,17.42 | 27.94,17.42 27.69,17.42 | 27.94,17.42 13.18,17.42 J8.3
PF1/ADC1
  Top 0.305: IC1.96 36.18,17.86 15.04,17.86 J8.4
PF2/ADC2
  Top 0.305: IC1.95 36.45,18.29 17.4,18.29 J8.5
PF3/ADC3
  Top 0.305: IC1.94 36.73,18.72 19.25,18.72 J8.6
PF4/ADC4
  Top 0.305: IC1.93 37,19.15 21.61,19.15 J8.7
PF5/ADC5
  Top 0.305: IC1.92 37.28,19.58 23.47,19.58 J8.8
PF6/ADC6
  Top 0.305: IC1.91 37.55,20.02 25.83,20.02 J8.9
PF7/ADC7
  Top 0.305: IC1.90 37.83,20.45 27.69,20.45 J8.10
PG0/IO41
  Top 0.305: IC1.51 57.25,14.48 57.66,14.48 59.18,12.95 59.18,9.6 61.8,6.99 82.04,6.99 J7.5
PG1/IO40
  Top 0.305: IC1.52 57.1,15.03 57.72,15.03 59.61,13.13 59.61,11.43 | 59.61,11.43 59.61,10.92 | J7.6 88.96,2.35 83.9,7.42 61.98,7.42 59.61,9.78 59.61,11.43
PG2/IO39
  Top 0.305: IC1.70 51.08,21.74 64.8,21.74 J10.7
PG5/IO4~
  Top 0.305: J8.2 10.82,16.99 32.79,16.99 34.29,15.49 34.29,13.21 34.8,12.7 36.16,12.7 36.34,12.52 36.34,12.04 IC1.1
PH0/RXD2/IO17
  Top 0.305: J1.7 21.61,6.5 39.37,6.5 | 39.37,6.5 40.09,6.5 | IC1.12 40.09,6.5 39.37,6.5
PH1/TXD2/IO16
  Top 0.305: IC1.13 40.36,6.07 23.98,6.07 J1.8
PH2  (via drill 0.41)
  Top 0.305: L3.C v22.86,10.67 | IC1.14 43.63,8.64 v43.69,8.64
  Bottom 0.305: v22.86,10.67 27.04,10.67 27.68,10.03 28.2,10.03 28.41,10.24 31.86,10.24 32.58,9.51 33.46,9.51 33.66,9.72 42.61,9.72 v43.69,8.64
PH3/IO6~
  Top 0.305: IC1.15 41.34,5.64 25.83,5.64 J1.9
PH4/IO7~
  Top 0.305: IC1.16 41.62,5.21 28.19,5.21 J1.10
PH5/IO8~
  Top 0.305: IC1.17 41.89,4.78 30.05,4.78 J2.1
PH6/IO9~
  Top 0.305: IC1.18 42.17,4.34 32.41,4.34 J2.2
PJ0/RXD3/IO15
  Top 0.305: IC1.63 55.17,20.88 69.01,20.88 J10.9
PJ1/TXD3/IO14
  Top 0.305: IC1.64 54.89,21.31 67.16,21.31 J10.8
PK0/ADC8
  Top 0.305: IC1.89 38.1,20.88 30.05,20.88 J9.1
PK1/ADC9
  Top 0.305: IC1.88 38.38,21.31 31.9,21.31 J9.2
PK2/ADC10
  Top 0.305: IC1.87 38.66,21.74 34.27,21.74 J9.3
PK3/ADC11
  Top 0.305: IC1.86 38.93,22.17 36.12,22.17 J9.4
PK4/ADC12
  Top 0.305: IC1.85 39.2,22.61 38.48,22.61 J9.5
PK5/ADC13
  Top 0.305: IC1.84 39.37,23.15 J9.6
PK6/ADC14
  Top 0.305: IC1.83 42.42,20.81 42.42,23.75 J9.7
PK7/ADC15
  Top 0.305: IC1.82 42.89,21.04 42.89,21.37 44.45,22.93 J9.8
PL0/IO49
  Top 0.305: J3.2 54.61,2.53 54.97,2.89 54.97,4.22 54.81,4.38 53.97,4.38 53.54,4.82 52.75,4.82 IC1.35
PL1/IO48
  Top 0.305: IC1.36 53.03,5.25 53.72,5.25 54.15,4.82 54.98,4.82 57.15,2.65 J3.3
PL2/IO47
  Top 0.305: IC1.37 53.3,5.68 53.9,5.68 54.33,5.25 55.16,5.25 58.18,2.23 58.6,2.23 J3.4
PL3/IO46~
  Top 0.305: IC1.38 53.58,6.11 54.08,6.11 54.51,5.68 55.34,5.68 58.36,2.67 60.96,2.67 J3.5
PL4/IO45~
  Top 0.305: IC1.39 53.85,6.54 54.26,6.54 54.69,6.11 55.52,6.11 58.53,3.1 62.81,3.1 J3.6
PL5/IO44~
  Top 0.305: IC1.40 54.13,6.98 54.43,6.98 54.87,6.54 55.7,6.54 58.71,3.53 65.18,3.53 J3.7
PL6/IO43
  Top 0.305: IC1.41 54.4,7.41 54.61,7.41 55.04,6.98 55.88,6.98 58.89,3.96 67.03,3.96 J3.8
PL7/IO42
  Top 0.305: IC1.42 54.68,7.84 54.79,7.84 55.22,7.41 56.06,7.41 59.07,4.39 69.39,4.39 J3.9
RESET
  Top 0.305: IC1.30 50.38,3.65 | 50.38,3.65 51.15,2.89 | 51.15,2.89 51.34,2.69 | J3.1 52.07,1.96 51.15,2.89 | 51.15,2.89 50.38,3.65 | R3.1 51.82,3.56 51.15,2.89
  Bottom 0.305: ICSP.5 10.13,12.22 10.13,12.83 9.65,13.31 9.65,14.42 8.89,15.19 7.88,15.19 7.06,14.37 7.06,10.93 6.35,10.21 5.34,10.21 4.19,11.36 4.19,14.65 5.16,15.62 7.09,15.62 7.52,16.05 9.24,16.05 9.68,15.62 11.61,15.62 12.57,14.65 12.57,10.75 12.35,10.52 12.35,9.3 15.02,6.63 34.49,6.63 38.33,2.79 50.67,2.79 J3.1
XTAL1  (via drill 0.41)
  Top 0.305: Y2.1 71.88,12.7 | 71.88,12.7 Y1.1 | IC1.34 50.22,6.65 50.22,10.34 v50.42,10.54 | R1.1 C9.1 71.88,16.93 71.88,12.7
  Bottom 0.305: v50.42,10.54 50.62,10.74 64.31,10.74 65.33,11.76 66.05,11.76 66.99,12.7 Y1.1
XTAL2  (via drill 0.41)
  Top 0.305: Y2.2 65.28,12.7 | 65.28,12.7 Y1.2 | IC1.33 49.78,6.37 v49.78,11.18 | R1.2 C2.1 64.69,13.29 65.28,12.7
  Bottom 0.305: v49.78,11.18 64.14,11.18 Y1.2